# Altium schematic sheet DigitalConnector.SchDoc
size A4; CompanyName: Technische Hochschule Nürnberg Georg Simon Ohm; Organization: UltraZohm; Address1: Kesslerplatz 12; Address2: 90489 Nürnberg; Address3: GERMANY; DocumentNumber: 3; SheetNumber: 3; SheetTotal: 3; Website: www.ultrazohm.com
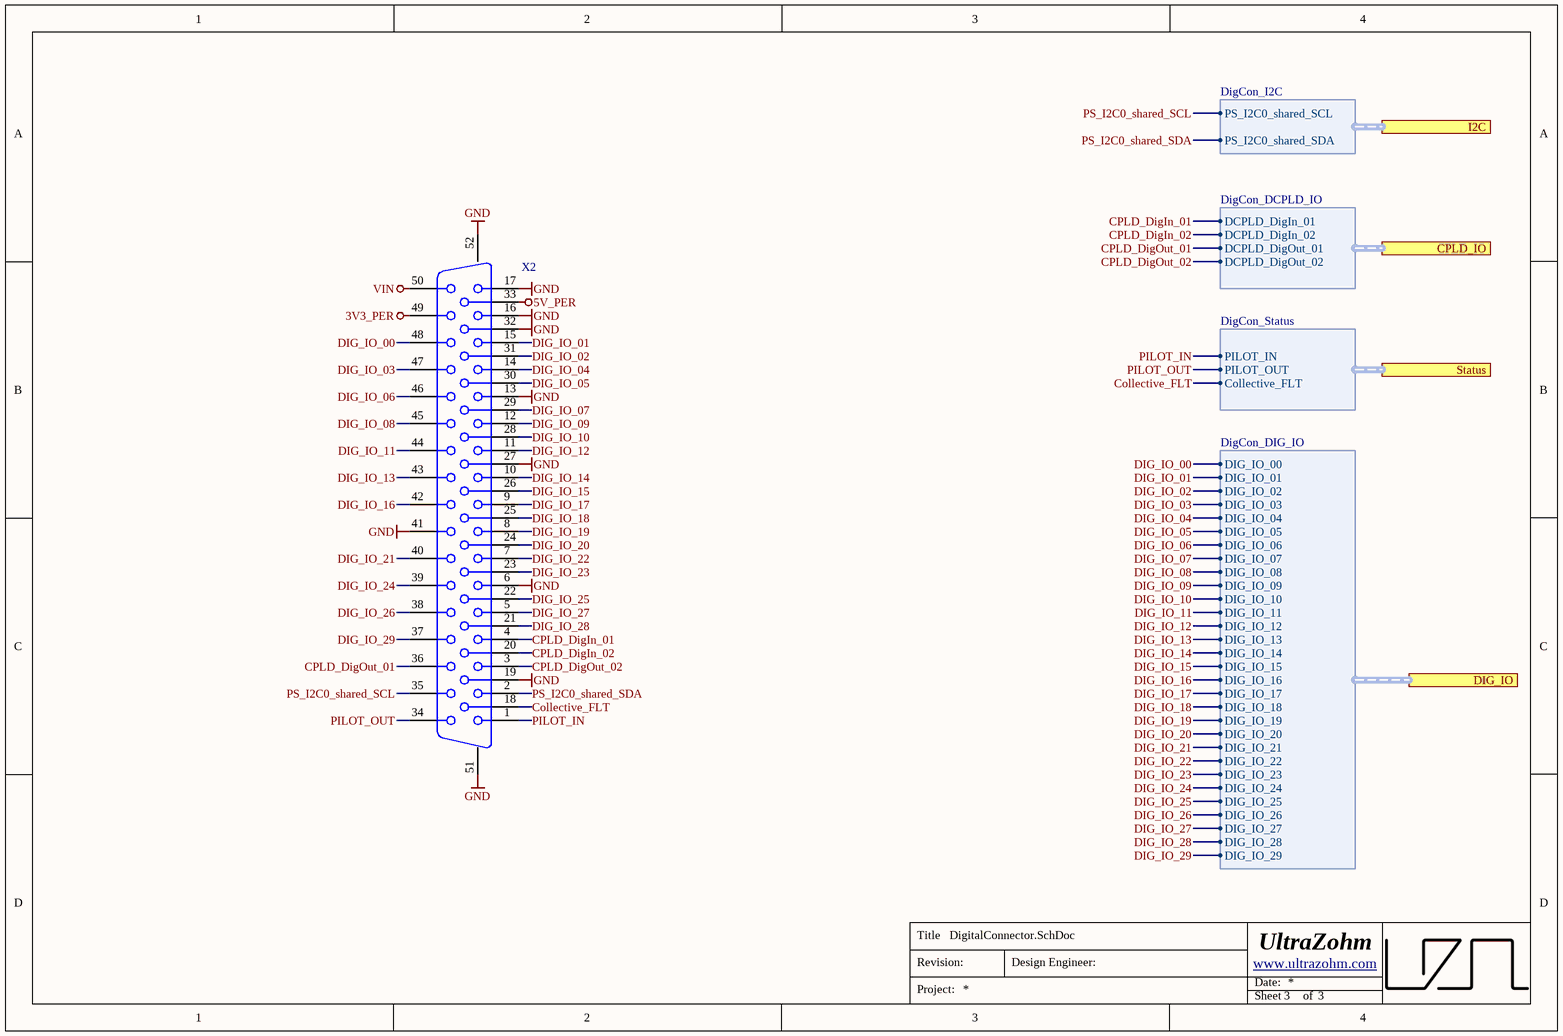
[diagram p0: DigitalConnector.SchDoc]

## Parts
X2  (no value)  [dsub50_female_164A18759X]

## Ports
CPLD_IO (harness DigCon_DCPLD_IO, see TopSheet[3B], CarrierConnector[4A]), DIG_IO (harness DigCon_DIG_IO, see TopSheet[3A], CarrierConnector[4C]), I2C (harness DigCon_I2C, see TopSheet[3B], CarrierConnector[4A]), Status (harness DigCon_Status, see TopSheet[3B], CarrierConnector[4B])

## Harnesses
DigCon_Status: PILOT_IN, PILOT_OUT, Collective_FLT
DigCon_DCPLD_IO: DCPLD_DigIn_01, DCPLD_DigIn_02, DCPLD_DigOut_01, DCPLD_DigOut_02
DigCon_DIG_IO: DIG_IO_01, DIG_IO_02, DIG_IO_03, DIG_IO_04, DIG_IO_05, DIG_IO_06, DIG_IO_07, DIG_IO_08, DIG_IO_09, DIG_IO_10, DIG_IO_11, DIG_IO_12, DIG_IO_13, DIG_IO_14, DIG_IO_15, DIG_IO_16, DIG_IO_17, DIG_IO_18, DIG_IO_19, DIG_IO_20, DIG_IO_21, DIG_IO_22, DIG_IO_23, DIG_IO_24, DIG_IO_25, DIG_IO_26, DIG_IO_27, DIG_IO_28, DIG_IO_29, DIG_IO_00
DigCon_I2C: PS_I2C0_shared_SDA, PS_I2C0_shared_SCL

## Nets
3V3_PER: X2.49
5V_PER: X2.33
GND: X2.6 X2.13 X2.16 X2.17 X2.19 X2.27 X2.32 X2.41 X2.51 X2.52
VIN: X2.50
Collective_FLT: X2.18 ; port Status.Collective_FLT
CPLD_DigIn_01: X2.4 ; port CPLD_IO.DCPLD_DigIn_01
CPLD_DigIn_02: X2.20 ; port CPLD_IO.DCPLD_DigIn_02
CPLD_DigOut_01: X2.36 ; port CPLD_IO.DCPLD_DigOut_01
CPLD_DigOut_02: X2.3 ; port CPLD_IO.DCPLD_DigOut_02
DIG_IO_00: X2.48 ; port DIG_IO.DIG_IO_00
DIG_IO_01: X2.15 ; port DIG_IO.DIG_IO_01
DIG_IO_02: X2.31 ; port DIG_IO.DIG_IO_02
DIG_IO_03: X2.47 ; port DIG_IO.DIG_IO_03
DIG_IO_04: X2.14 ; port DIG_IO.DIG_IO_04
DIG_IO_05: X2.30 ; port DIG_IO.DIG_IO_05
DIG_IO_06: X2.46 ; port DIG_IO.DIG_IO_06
DIG_IO_07: X2.29 ; port DIG_IO.DIG_IO_07
DIG_IO_08: X2.45 ; port DIG_IO.DIG_IO_08
DIG_IO_09: X2.12 ; port DIG_IO.DIG_IO_09
DIG_IO_10: X2.28 ; port DIG_IO.DIG_IO_10
DIG_IO_11: X2.44 ; port DIG_IO.DIG_IO_11
DIG_IO_12: X2.11 ; port DIG_IO.DIG_IO_12
DIG_IO_13: X2.43 ; port DIG_IO.DIG_IO_13
DIG_IO_14: X2.10 ; port DIG_IO.DIG_IO_14
DIG_IO_15: X2.26 ; port DIG_IO.DIG_IO_15
DIG_IO_16: X2.42 ; port DIG_IO.DIG_IO_16
DIG_IO_17: X2.9 ; port DIG_IO.DIG_IO_17
DIG_IO_18: X2.25 ; port DIG_IO.DIG_IO_18
DIG_IO_19: X2.8 ; port DIG_IO.DIG_IO_19
DIG_IO_20: X2.24 ; port DIG_IO.DIG_IO_20
DIG_IO_21: X2.40 ; port DIG_IO.DIG_IO_21
DIG_IO_22: X2.7 ; port DIG_IO.DIG_IO_22
DIG_IO_23: X2.23 ; port DIG_IO.DIG_IO_23
DIG_IO_24: X2.39 ; port DIG_IO.DIG_IO_24
DIG_IO_25: X2.22 ; port DIG_IO.DIG_IO_25
DIG_IO_26: X2.38 ; port DIG_IO.DIG_IO_26
DIG_IO_27: X2.5 ; port DIG_IO.DIG_IO_27
DIG_IO_28: X2.21 ; port DIG_IO.DIG_IO_28
DIG_IO_29: X2.37 ; port DIG_IO.DIG_IO_29
PILOT_IN: X2.1 ; port Status.PILOT_IN
PILOT_OUT: X2.34 ; port Status.PILOT_OUT
PS_I2C0_shared_SCL: X2.35 ; port I2C.PS_I2C0_shared_SCL
PS_I2C0_shared_SDA: X2.2 ; port I2C.PS_I2C0_shared_SDA

## Notes on the sheet
- Title
- Revision:
- Design Engineer:
- Date:
- Project:
- Sheet
- of

## Library data of the parts
X2 = 164A18759X: D-Sub Standard Connectors DSUB SOLDER PIN ANG 9.4mm; MF: CONEC; Created from: AGeiger; MPN: 164A18759X; Value: 164A18759X; Supplier Part Number 1: D-SUB BU 50GWC; ComponentLink1Description: Datasheet; ComponentLink1URL: https://conec.com/catalog/pub/media/conec/drawings/164A18759X.pdf; Supplier Part Number 2: 706-164A18759X; Supplier 1: Reichelt; Supplier 2: Mouser; Supplier 3: Digi-Key; Supplier Part Number 3: 164A18759X-ND; Created: 2019_10_24_AGeiger; Manufacturer Part Number: 164A18759X; PartID: 2; Created On: 22.12.2022 17:03:01; Last Updated: 22.12.2022 17:05:07; Manufacturer: CONEC; Mounting Type: THT; Operating Temperature: -55 °C to +125 °C; Series: D-SUB Standard